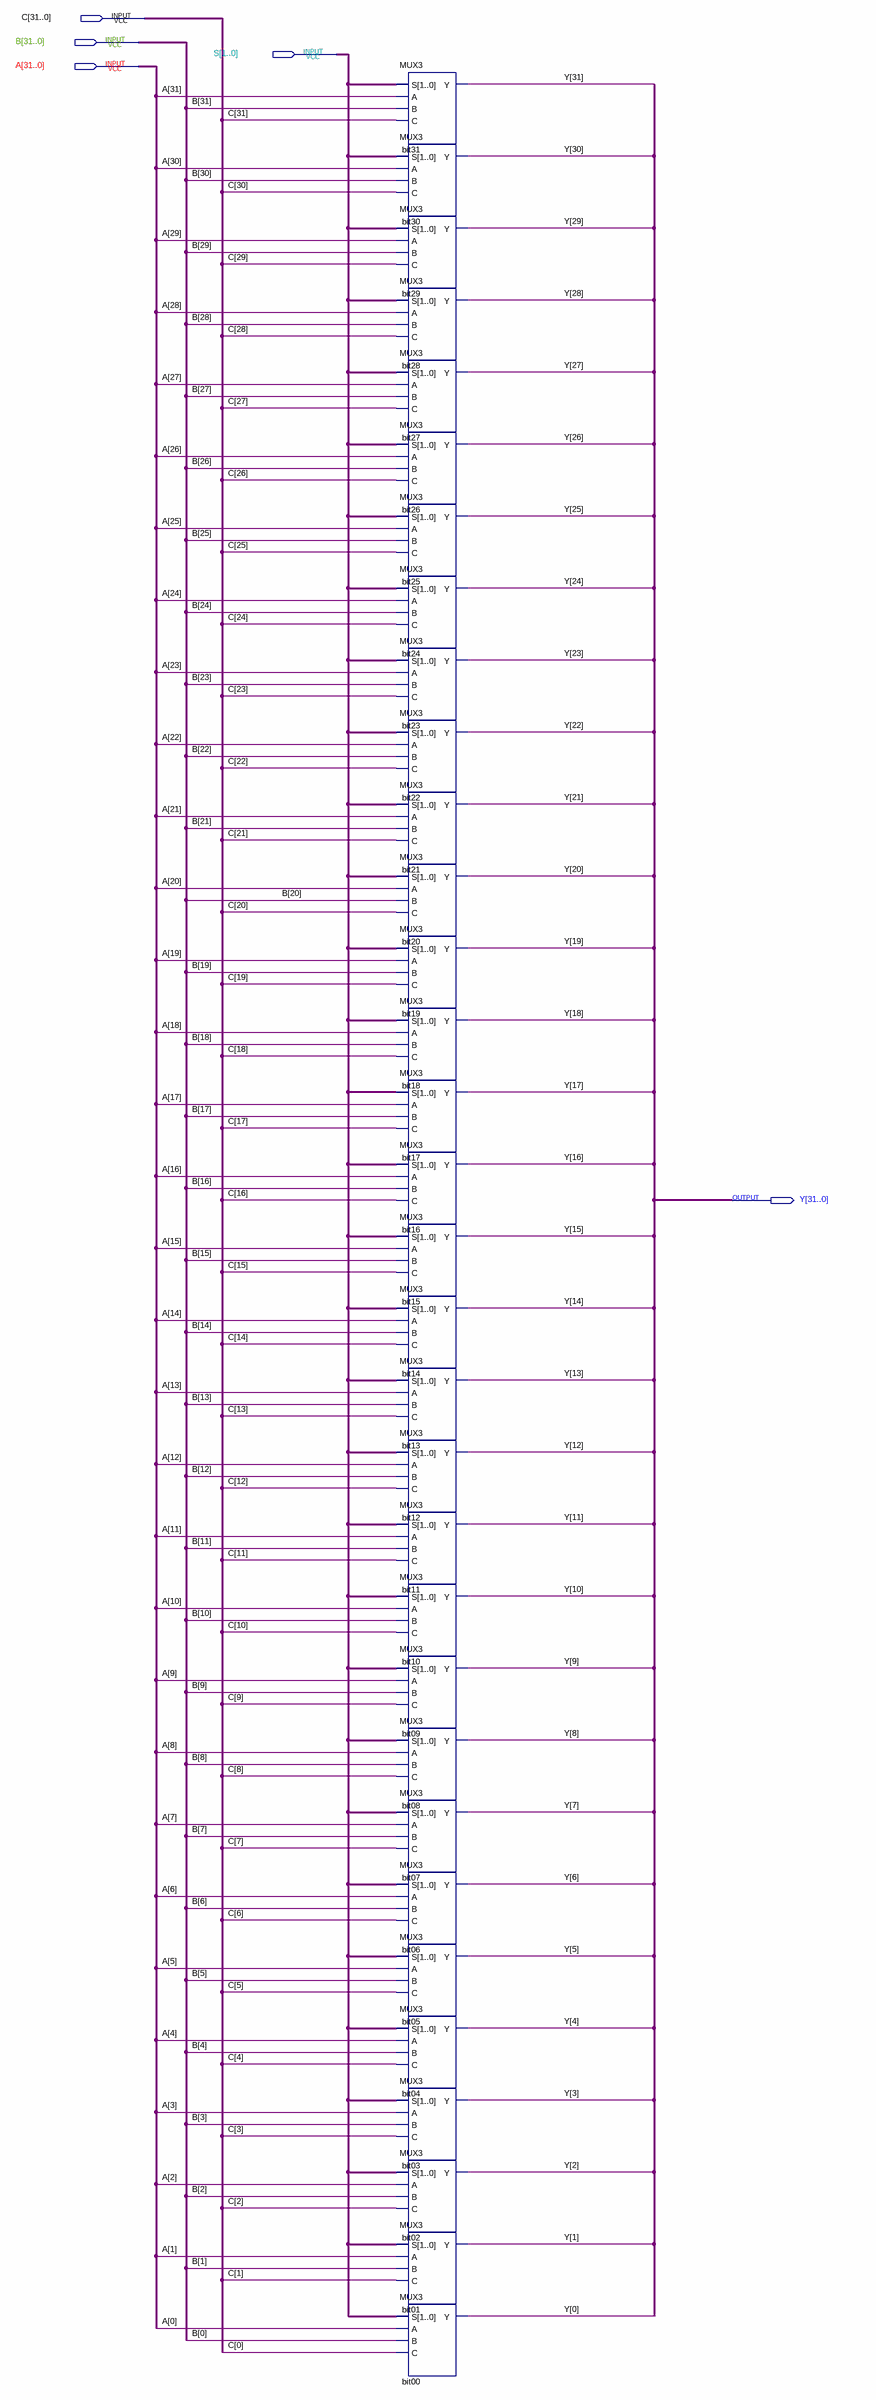
[diagram p0: schematic sheet]
// Quartus schematic MUX3_32.bdf as structural Verilog: 32 symbols, 5 pins
module MUX3_32 (
  input  [31:0] C,
  input  [31:0] B,
  input  [1:0] S,
  input  [31:0] A,
  output [31:0] Y
);

  MUX3 bit31 (.S(S), .A(A[31]), .B(B[31]), .C(C[31]), .Y(Y[31]));
  MUX3 bit30 (.S(S), .A(A[30]), .B(B[30]), .C(C[30]), .Y(Y[30]));
  MUX3 bit29 (.S(S), .A(A[29]), .B(B[29]), .C(C[29]), .Y(Y[29]));
  MUX3 bit28 (.S(S), .A(A[28]), .B(B[28]), .C(C[28]), .Y(Y[28]));
  MUX3 bit27 (.S(S), .A(A[27]), .B(B[27]), .C(C[27]), .Y(Y[27]));
  MUX3 bit26 (.S(S), .A(A[26]), .B(B[26]), .C(C[26]), .Y(Y[26]));
  MUX3 bit25 (.S(S), .A(A[25]), .B(B[25]), .C(C[25]), .Y(Y[25]));
  MUX3 bit24 (.S(S), .A(A[24]), .B(B[24]), .C(C[24]), .Y(Y[24]));
  MUX3 bit23 (.S(S), .A(A[23]), .B(B[23]), .C(C[23]), .Y(Y[23]));
  MUX3 bit22 (.S(S), .A(A[22]), .B(B[22]), .C(C[22]), .Y(Y[22]));
  MUX3 bit21 (.S(S), .A(A[21]), .B(B[21]), .C(C[21]), .Y(Y[21]));
  MUX3 bit20 (.S(S), .A(A[20]), .B(B[20]), .C(C[20]), .Y(Y[20]));
  MUX3 bit19 (.S(S), .A(A[19]), .B(B[19]), .C(C[19]), .Y(Y[19]));
  MUX3 bit18 (.S(S), .A(A[18]), .B(B[18]), .C(C[18]), .Y(Y[18]));
  MUX3 bit17 (.S(S), .A(A[17]), .B(B[17]), .C(C[17]), .Y(Y[17]));
  MUX3 bit16 (.S(S), .A(A[16]), .B(B[16]), .C(C[16]), .Y(Y[16]));
  MUX3 bit15 (.S(S), .A(A[15]), .B(B[15]), .C(C[15]), .Y(Y[15]));
  MUX3 bit14 (.S(S), .A(A[14]), .B(B[14]), .C(C[14]), .Y(Y[14]));
  MUX3 bit13 (.S(S), .A(A[13]), .B(B[13]), .C(C[13]), .Y(Y[13]));
  MUX3 bit12 (.S(S), .A(A[12]), .B(B[12]), .C(C[12]), .Y(Y[12]));
  MUX3 bit11 (.S(S), .A(A[11]), .B(B[11]), .C(C[11]), .Y(Y[11]));
  MUX3 bit10 (.S(S), .A(A[10]), .B(B[10]), .C(C[10]), .Y(Y[10]));
  MUX3 bit09 (.S(S), .A(A[9]), .B(B[9]), .C(C[9]), .Y(Y[9]));
  MUX3 bit08 (.S(S), .A(A[8]), .B(B[8]), .C(C[8]), .Y(Y[8]));
  MUX3 bit07 (.S(S), .A(A[7]), .B(B[7]), .C(C[7]), .Y(Y[7]));
  MUX3 bit06 (.S(S), .A(A[6]), .B(B[6]), .C(C[6]), .Y(Y[6]));
  MUX3 bit05 (.S(S), .A(A[5]), .B(B[5]), .C(C[5]), .Y(Y[5]));
  MUX3 bit04 (.S(S), .A(A[4]), .B(B[4]), .C(C[4]), .Y(Y[4]));
  MUX3 bit03 (.S(S), .A(A[3]), .B(B[3]), .C(C[3]), .Y(Y[3]));
  MUX3 bit02 (.S(S), .A(A[2]), .B(B[2]), .C(C[2]), .Y(Y[2]));
  MUX3 bit01 (.S(S), .A(A[1]), .B(B[1]), .C(C[1]), .Y(Y[1]));
  MUX3 bit00 (.S(S), .A(A[0]), .B(B[0]), .C(C[0]), .Y(Y[0]));
endmodule
